# Altium project PID_preheaterV1.PrjPcb
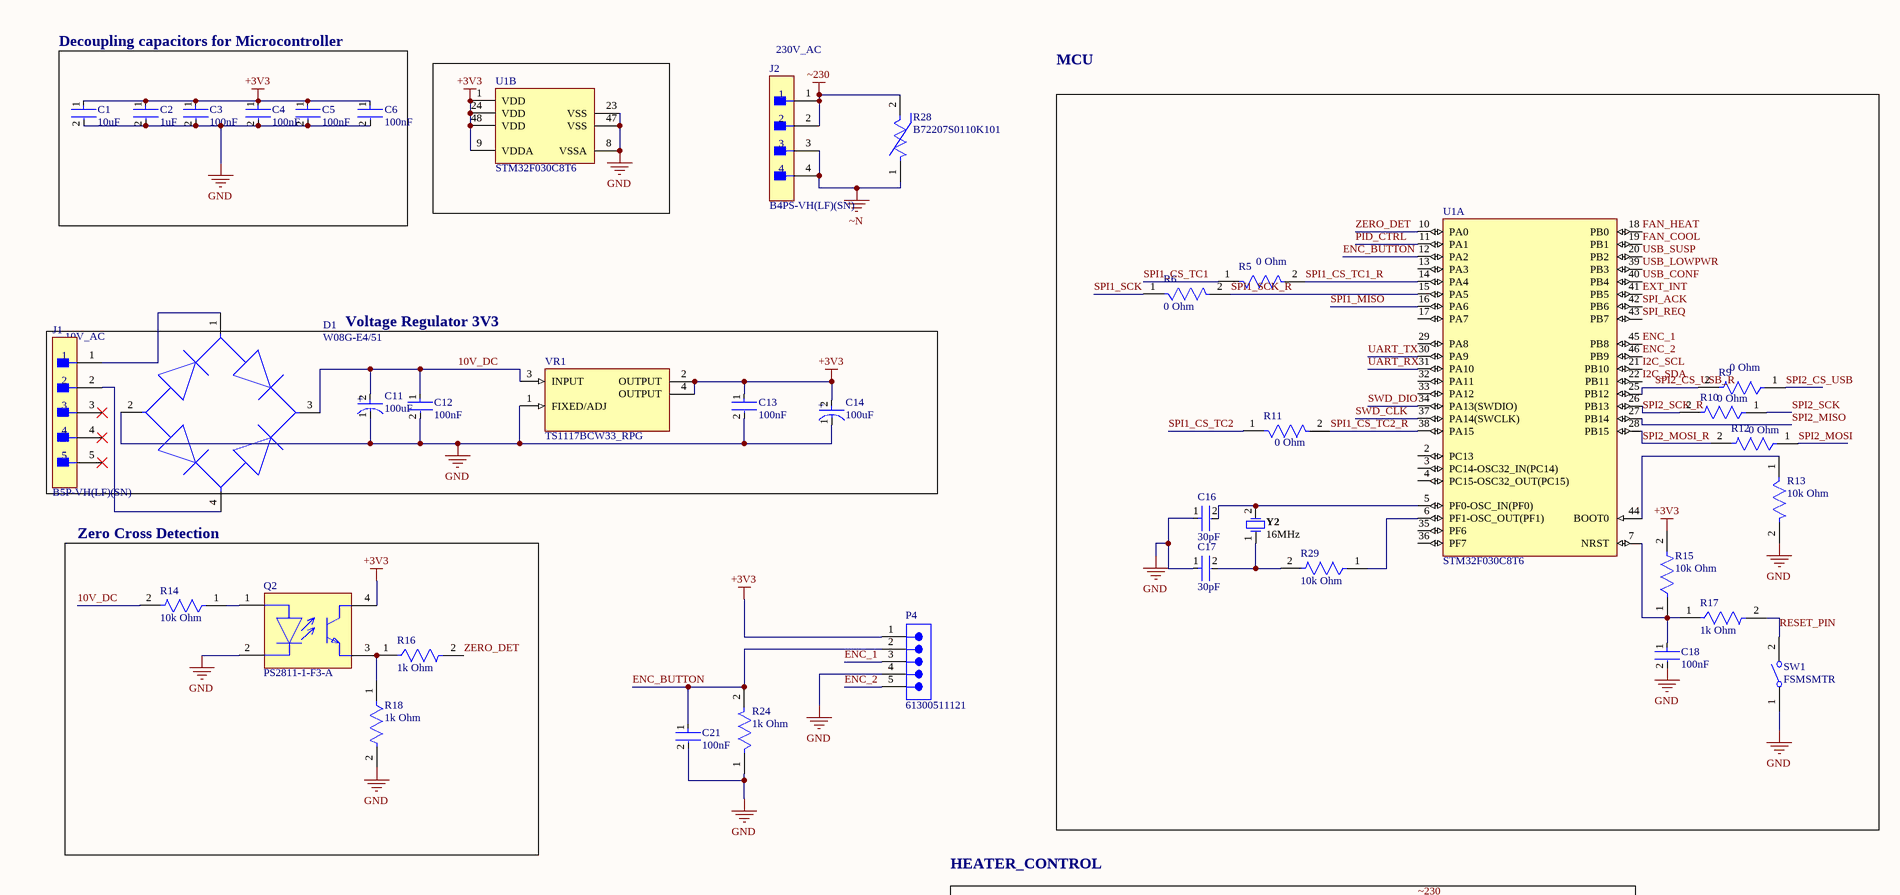
[diagram p0: SheetV1.SchDoc, top left]
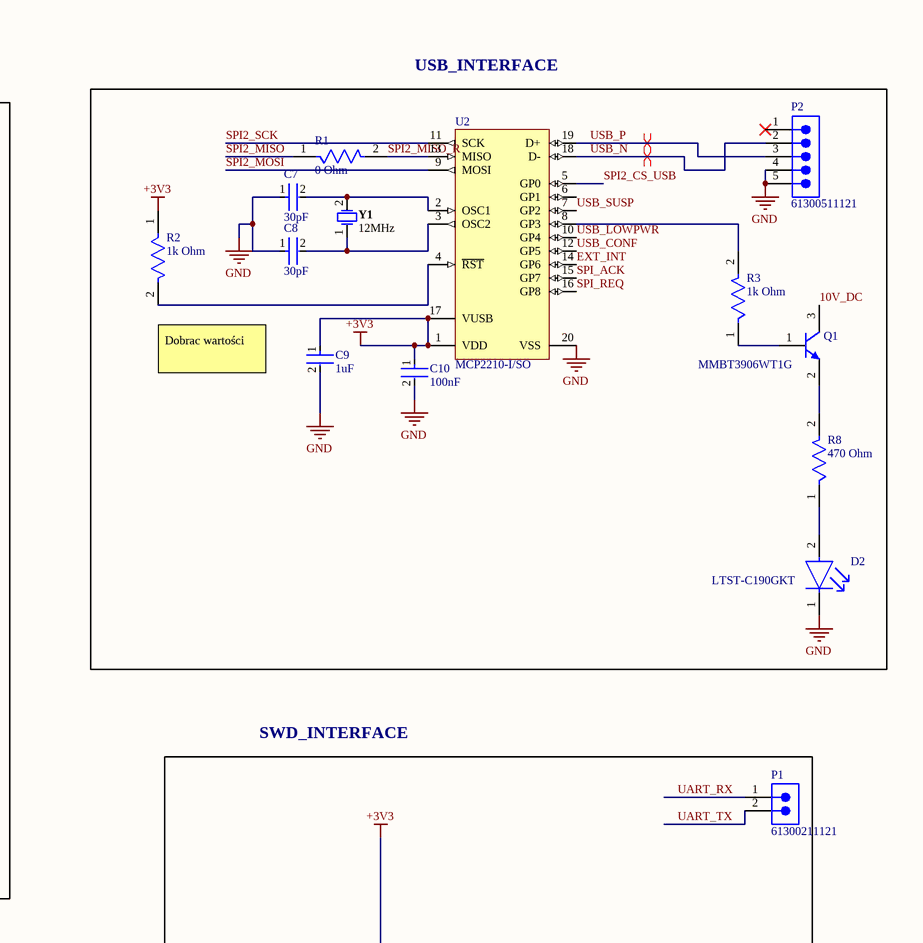
[diagram p1: SheetV1.SchDoc, top right]
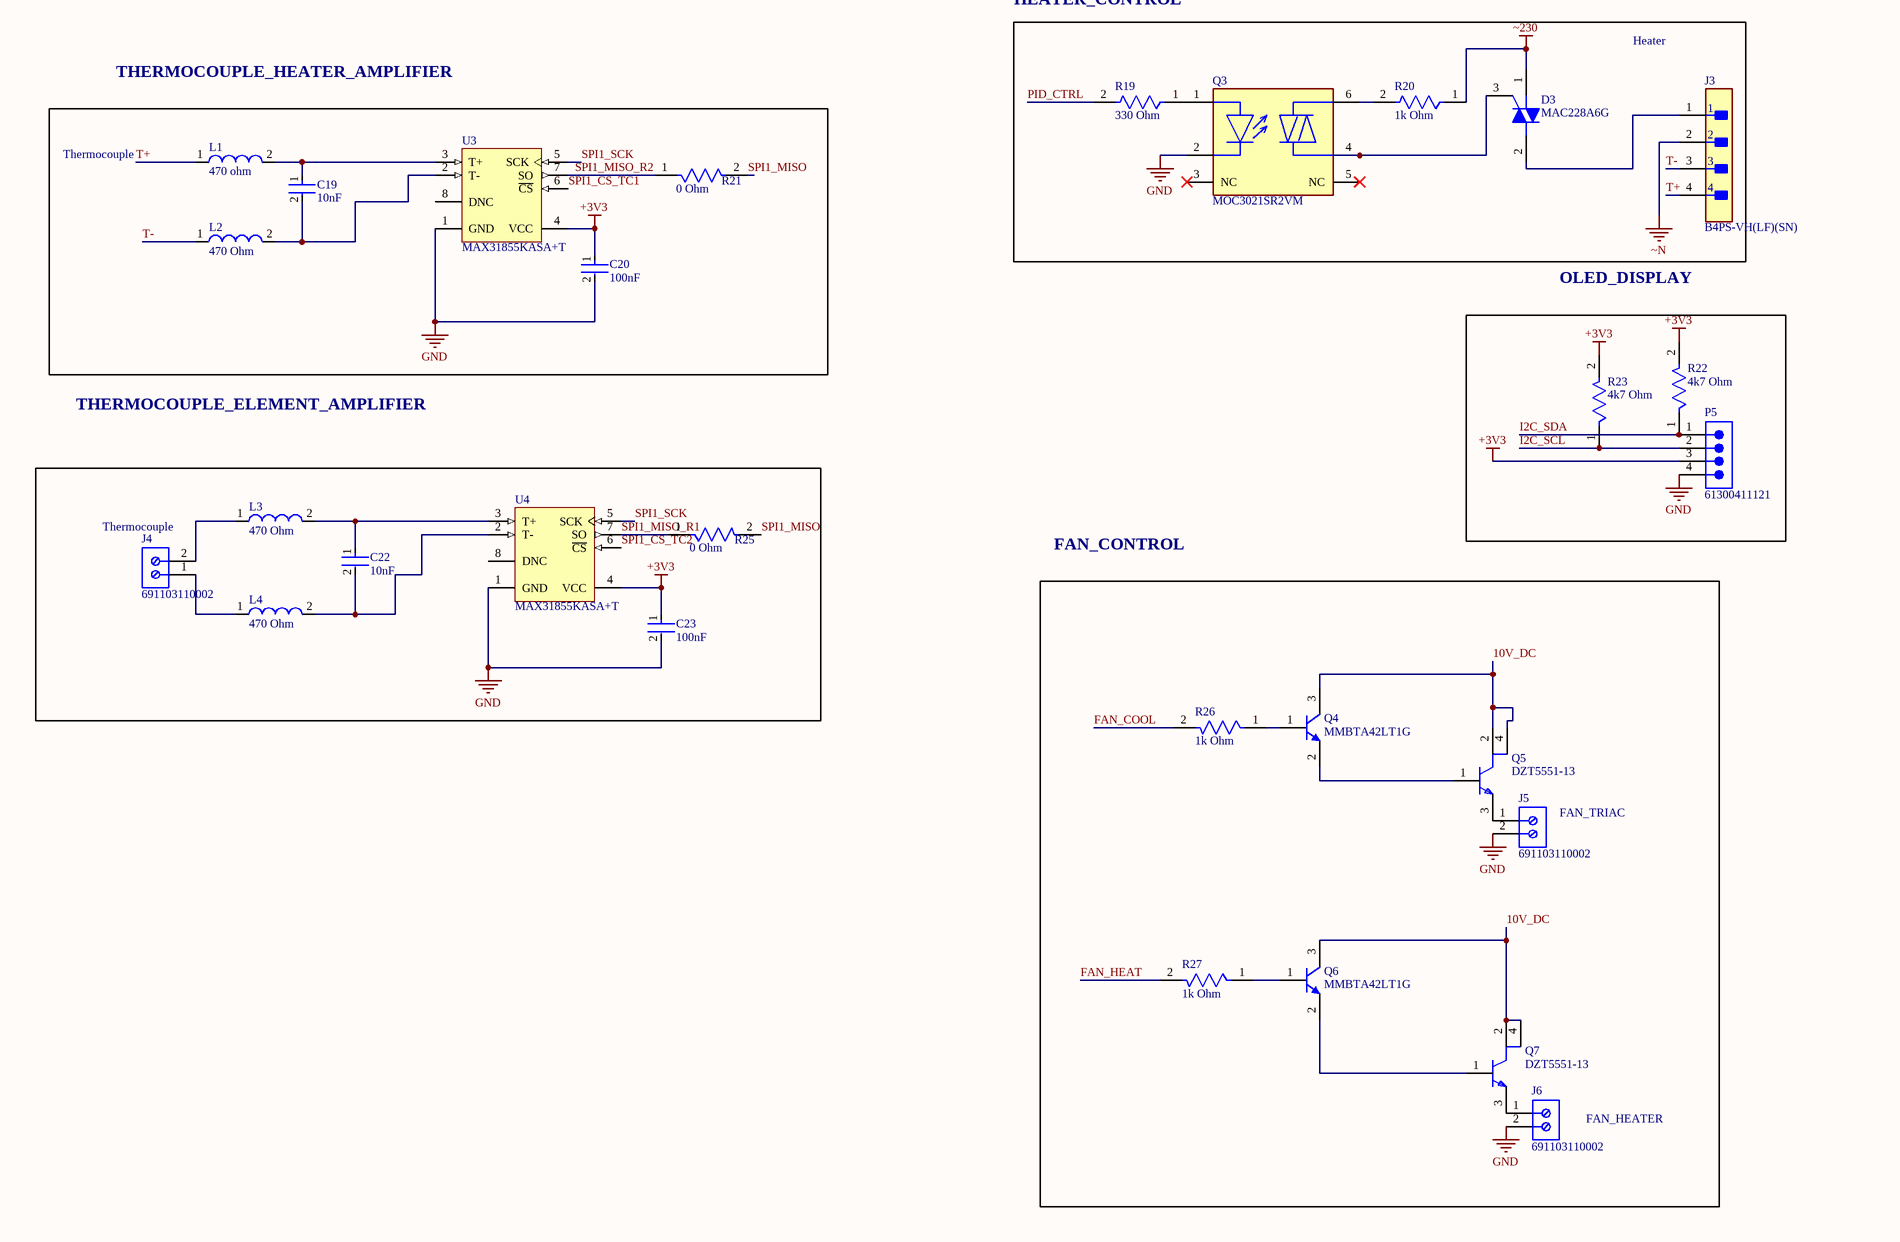
[diagram p2: SheetV1.SchDoc, bottom left]
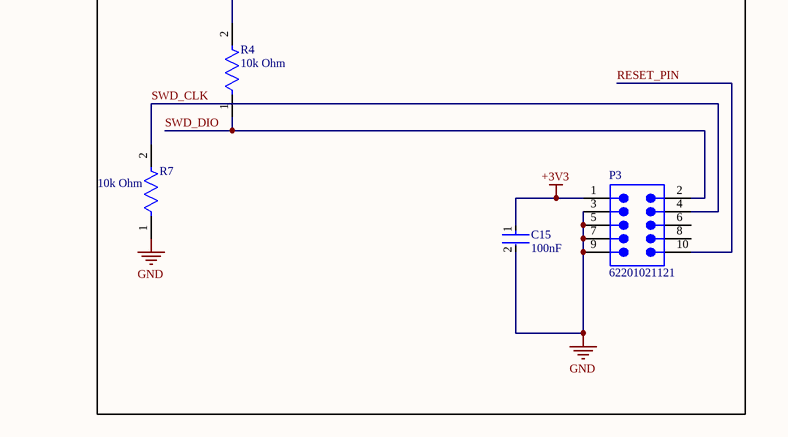
[diagram p3: SheetV1.SchDoc, bottom right]
1 sheet, 85 parts. Net scope: global (net labels, ports and power ports of the same name join across sheets).
Board file: PCBV1.PcbDoc

## Sheet SheetV1.SchDoc: PID Heater upgrade
size A1; Author: Grzegorz Jabłoński; DrawnBy: Grzegorz Jabłoński; DocumentNumber: 1/1; Revision: V1.0; SheetNumber: 1; SheetTotal: 1

### Parts
C1  10uF  [FP-CC0805-0_85-MFG]
C2  1uF  [FP-CC0805-0_85-MFG]
C3  100nF  [FP-CC0805-0_85-MFG]
C4  100nF  [FP-CC0805-0_85-MFG]
C5  100nF  [FP-CC0805-0_85-MFG]
C6  100nF  [FP-CC0805-0_85-MFG]
C7  30pF  [FP-CC0805-0_85-MFG]
C8  30pF  [FP-CC0805-0_85-MFG]
C9  1uF  [FP-CC0805-0_85-MFG]
C10  100nF  [FP-CC0805-0_85-MFG]
C11  100uF  [FP-RAD-TH-D_10_0_5-L_12_5-MFG]
C12  100nF  [FP-CC0805-0_85-MFG]
C13  100nF  [FP-CC0805-0_85-MFG]
C14  100uF  [FP-RAD-TH-D_10_0_5-L_12_5-MFG]
C15  100nF  [FP-CC0805-0_85-MFG]
C16  30pF  [FP-CC0805-0_85-MFG]
C17  30pF  [FP-CC0805-0_85-MFG]
C18  100nF  [FP-CC0805-0_85-MFG]
C19  10nF  [FP-CC0805-0_85-MFG]
C20  100nF  [FP-CC0805-0_85-MFG]
C21  100nF  [FP-CC0805-0_85-MFG]
C22  10nF  [FP-CC0805-0_85-MFG]
C23  100nF  [FP-CC0805-0_85-MFG]
D1  W08G-E4/51  [FP-WOG-MFG]
D2  LTST-C190GKT  [FP-LTST-C190GKT-MFG]
D3  MAC228A6G  [ONSC-TO-220-3-221A-09]
J1  B5P-VH(LF)(SN)  [FP-B5P-VH_LF_SN-MFG]
J2  B4PS-VH(LF)(SN)  [FP-B4PS-VH_LF_SN-MFG]
J3  B4PS-VH(LF)(SN)  [FP-B4PS-VH_LF_SN-MFG]
J4  691103110002  [691103110002]
J5  691103110002  [691103110002]
J6  691103110002  [691103110002]
L1  470 ohm  [SMD-0805]
L2  470 Ohm  [SMD-0805]
L3  470 Ohm  [SMD-0805]
L4  470 Ohm  [SMD-0805]
P1  61300211121  [61300211121]
P2  61300511121  [61300511121]
P3  62201021121  [62201021121]
P4  61300511121  [61300511121]
P5  61300411121  [61300411121]
Q1  MMBT3906WT1G  [ONSC-SC-70-3-419-04_V]
Q2  PS2811-1-F3-A  [SOP127P700X210_HS-5_SO4-Opto2_N]
Q3  MOC3021SR2VM  [FP-646BY-MFG]
Q4  MMBTA42LT1G  [ONSC-SOT-23-3-318-08_V]
Q5  DZT5551-13  [FP-SOT223-MFG]
Q6  MMBTA42LT1G  [ONSC-SOT-23-3-318-08_V]
Q7  DZT5551-13  [FP-SOT223-MFG]
R1  0 Ohm  [FP-RMCF0805-MFG]
R2  1k Ohm  [FP-RMCF0805-MFG]
R3  1k Ohm  [FP-RMCF0805-MFG]
R4  10k Ohm  [FP-RMCF0805-MFG]
R5  0 Ohm  [FP-RMCF0805-MFG]
R6  0 Ohm  [FP-RMCF0805-MFG]
R7  10k Ohm  [FP-RMCF0805-MFG]
R8  470 Ohm  [FP-RMCF0805-MFG]
R9  0 Ohm  [FP-RMCF0805-MFG]
R10  0 Ohm  [FP-RMCF0805-MFG]
R11  0 Ohm  [FP-RMCF0805-MFG]
R12  0 Ohm  [FP-RMCF0805-MFG]
R13  10k Ohm  [FP-RMCF0805-MFG]
R14  10k Ohm  [FP-RMCF0805-MFG]
R15  10k Ohm  [FP-RMCF0805-MFG]
R16  1k Ohm  [FP-RMCF0805-MFG]
R17  1k Ohm  [FP-RMCF0805-MFG]
R18  1k Ohm  [FP-RMCF0805-MFG]
R19  330 Ohm  [FP-RMCF0805-MFG]
R20  1k Ohm  [FP-RMCF0805-MFG]
R21  0 Ohm  [FP-RMCF0805-MFG]
R22  4k7 Ohm  [FP-RMCF0805-MFG]
R23  4k7 Ohm  [FP-RMCF0805-MFG]
R24  1k Ohm  [FP-RMCF0805-MFG]
R25  0 Ohm  [FP-RMCF0805-MFG]
R26  1k Ohm  [FP-RMCF0805-MFG]
R27  1k Ohm  [FP-RMCF0805-MFG]
R28  B72207S0110K101  [FP-B72207S0110K101-MFG]
R29  10k Ohm  [FP-RMCF0805-MFG]
SW1  FSMSMTR  [TECO-FSMSMTR_V]
U1  STM32F030C8T6  [STM-LQFP48_M]  (parts A,B of 2)
U2  MCP2210-I/SO  [SOIC-SO20_N]
U3  MAX31855KASA+T  [MAXM-S8+4_N]
U4  MAX31855KASA+T  [MAXM-S8+4_N]
VR1  TS1117BCW33_RPG  [VREG_TS1117BCW50_RPG]
Y1  12MHz  [FOX-FOXSLF160-20]
Y2  16MHz  [FOX-FOXSLF160-20]

### Blocks framed on the sheet
Decoupling capacitors for Microcontroller: C1-C6
USB_INTERFACE: C7-C10 D2 P2 Q1 R1-R3 R8 U2 Y1
Voltage Regulator 3V3: C11-C14 D1 J1 VR1
Zero Cross Detection: Q2 R14 R16 R18
SWD_INTERFACE: C15 P1 P3 R4 R7
HEATER_CONTROL: D3 J3 Q3 R19 R20
Thermocouple: C19 C20 L1 L2 R21 U3
Thermocouple: C22 C23 J4 L3 L4 R25 U4

### Nets
+3V3: C1.1 C2.1 C3.1 C4.1 C5.1 C6.1 C9.1 C10.1 C13.1 C14.2(A) C15.1 C20.1 C23.1 P3.1 P4.1 P5.3 Q2.4(C) R2.1 R4.2 R15.2 R22.2 R23.2 U1.1(VDD) U1.9(VDDA) U1.24(VDD) U1.48(VDD) U2.1(VDD) U2.17(VUSB) U3.4(VCC) U4.4(VCC) VR1.2(OUTPUT) VR1.4(OUTPUT)
GND: C1.2 C2.2 C3.2 C4.2 C5.2 C6.2 C7.1 C8.1 C9.2 C10.2 C11.1(C) C12.2 C13.2 C14.1(C) C15.2 C16.1 C17.1 C18.2 C20.2 C21.2 C23.2 D1.2(+) D2.1(C) J5.2 J6.2 P2.4 P2.5 P3.3 P3.5 P3.7 P3.9 P4.4 P5.4 Q2.2(C) Q3.2(C) R7.1 R13.2 R18.2 R24.1 SW1.1 U1.8(VSSA) U1.23(VSS) U1.47(VSS) U2.20(VSS) U3.1(GND) U4.1(GND) VR1.1(FIXED/ADJ)
~230: D3.1(MT1) J2.1 J2.2 R20.1 R28.2
~N: J2.3 J2.4 J3.2 R28.1
10V_DC: C11.2(A) C12.1 D1.3(-) Q1.3(C) Q4.3(C) Q5.2(C) Q5.4(C) Q6.3(C) Q7.2(C) Q7.4(C) R14.2 VR1.3(INPUT)
ENC_1: P4.3 U1.45(PB8)
ENC_2: P4.5 U1.46(PB9)
ENC_BUTTON: C21.1 P4.2 R24.2 U1.12(PA2)
EXT_INT: U1.41(PB5) U2.14(GP6)
FAN_COOL: R26.2 U1.19(PB1)
FAN_HEAT: R27.2 U1.18(PB0)
I2C_SCL: P5.2 R23.1 U1.21(PB10)
I2C_SDA: P5.1 R22.1 U1.22(PB11)
PID_CTRL: R19.2 U1.11(PA1)
RESET_PIN: P3.10 R17.2 SW1.2
SPI1_CS_TC1: R5.1 U3.6(~{CS})
SPI1_CS_TC1_R: R5.2 U1.14(PA4)
SPI1_CS_TC2: R11.1 U4.6(~{CS})
SPI1_CS_TC2_R: R11.2 U1.38(PA15)
SPI1_MISO: R21.2 R25.2 U1.16(PA6)
SPI1_MISO_R1: R25.1 U4.7(SO)
SPI1_MISO_R2: R21.1 U3.7(SO)
SPI1_SCK: R6.1 U3.5(SCK) U4.5(SCK)
SPI1_SCK_R: R6.2 U1.15(PA5)
SPI2_CS_USB: R9.1 U2.5(GP0)
SPI2_CS_USB_R: R9.2 U1.25(PB12)
SPI2_MISO: R1.1 U1.27(PB14)
SPI2_MISO_R: R1.2 U2.13(MISO)
SPI2_MOSI: R12.1 U2.9(MOSI)
SPI2_MOSI_R: R12.2 U1.28(PB15)
SPI2_SCK: R10.1 U2.11(SCK)
SPI2_SCK_R: R10.2 U1.26(PB13)
SPI_ACK: U1.42(PB6) U2.15(GP7)
SPI_REQ: U1.43(PB7) U2.16(GP8)
SWD_CLK: P3.4 R7.2 U1.37(PA14(SWCLK))
SWD_DIO: P3.2 R4.1 U1.34(PA13(SWDIO))
T+: J3.4 L1.1
T-: J3.3 L2.1
UART_RX: P1.1 U1.31(PA10)
UART_TX: P1.2 U1.30(PA9)
USB_CONF: U1.40(PB4) U2.12(GP5)
USB_LOWPWR: U1.39(PB3) U2.10(GP4)
USB_N: P2.2 U2.18(D-)
USB_P: P2.3 U2.19(D+)
USB_SUSP: U1.20(PB2) U2.7(GP2)
ZERO_DET: R16.2 U1.10(PA0)
NetC7_2: C7.2 U2.2(OSC1) Y1.2
NetC8_2: C8.2 U2.3(OSC2) Y1.1
NetC16_2: C16.2 U1.5(PF0-OSC_IN(PF0)) Y2.2
NetC17_2: C17.2 R29.2 Y2.1
NetC18_1: C18.1 R15.1 R17.1 U1.7(NRST)
NetC19_1: C19.1 L1.2 U3.3(T+)
NetC19_2: C19.2 L2.2 U3.2(T-)
NetC22_1: C22.1 L3.2 U4.3(T+)
NetC22_2: C22.2 L4.2 U4.2(T-)
NetD1_1: D1.1(1_~) J1.1
NetD1_4: D1.4(2_~) J1.2
NetD2_2: D2.2(A) R8.1
NetD3_2: D3.2(MT2) J3.1
NetD3_3: D3.3(G) Q3.4(1_MAIN_TERM)
NetJ4_1: J4.1 L4.1
NetJ4_2: J4.2 L3.1
NetJ5_1: J5.1 Q5.3(E)
NetJ6_1: J6.1 Q7.3(E)
NetQ1_1: Q1.1(B) R3.1
NetQ1_2: Q1.2(E) R8.2
NetQ2_1: Q2.1(A) R14.1
NetQ2_3: Q2.3(E) R16.1 R18.1
NetQ3_1: Q3.1(A) R19.1
NetQ3_6: Q3.6(2_MAIN_TERM) R20.2
NetQ4_1: Q4.1(B) R26.1
NetQ4_2: Q4.2(E) Q5.1(B)
NetQ6_1: Q6.1(B) R27.1
NetQ6_2: Q6.2(E) Q7.1(B)
NetR2_2: R2.2 U2.4(~{RST})
NetR3_2: R3.2 U2.8(GP3)
NetR13_1: R13.1 U1.44(BOOT0)
NetR29_1: R29.1 U1.6(PF1-OSC_OUT(PF1))

Not connected (* = marked no-connect by the designer): J1 3* 4* 5*; P2 1*; P3 6 8; Q3 3(NC)* 5(NC)*; U1 2(PC13) 3(PC14-OSC32_IN(PC14)) 4(PC15-OSC32_OUT(PC15)) 13(PA3) 17(PA7) 29(PA8) 32(PA11) 33(PA12) 35(PF6) 36(PF7); U2 6(GP1); U3 8(DNC); U4 8(DNC)

### Layout directives
differential pair: USB_N, USB_P

### Notes on the sheet
- (near J2) 230V_AC
- MCU
- (near J1) 10V_AC
- Dobrac wartości
- THERMOCOUPLE_HEATER_AMPLIFIER
- Heater
- OLED_DISPLAY
- THERMOCOUPLE_ELEMENT_AMPLIFIER
- FAN_CONTROL
- FAN_TRIAC
- FAN_HEATER
- (in symbol CMP-05427-001012-1) +

### Library data of the parts
C1 C2 C7-C9 C16 C17 C19 C22 = CMP-2100-03606-3: CAP CER 0.1UF 50V X7R 0805; Manufacturer Part Number: CC0805KRX7R9BB104; Manufacturer: Yageo; Tolerance: 0.1; Capacitance: 100 nF; Value: 100 nF; Material: Ceramic; Device Class L1: Passive Components; ComponentLink2Description: Datasheet; Package: CC0805-0.85; Digikey Description: CAP CER 0.1UF 50V X7R 0805; Device Class L3: Ceramic Capacitors; Temperature: -30°C to +85°C; Temperature Characteristic: X7R; Voltage Rating: 50 V; Height: 0.95mm; RoHS: TRUE; Ipc Land Pattern Name: CAPC200125X85; Device Class L2: Capacitors; Category: Cap; Temperature Range Low: -30°C; Temperature Range High: +85°C; Mouser Description: Multilayer Ceramic Capacitors MLCC - SMD/SMT 100nF 50V X7R 10%; Footprint Url: http://www.yageo.com/exep/pages/download/literatures/UPY-C_GEN_24.pdf; Automotive: No; Octopart: https://octopart.com/cc0805krx7r9bb104-yageo-192993; Lead Free: Yes; ComponentLink2URL: http://www.yageo.com/documents/recent/UPY-GPHC_Y5V_6.3V-to-50V_8.pdf
C3-C6 C10 C12 C13 C15 C18 C20 C21 C23 = CMP-2100-03606-3: CAP CER 0.1UF 50V X7R 0805; Manufacturer Part Number: CC0805KRX7R9BB104; Manufacturer: Yageo; Tolerance: 0.1; Material: Ceramic; Device Class L1: Passive Components; ComponentLink2Description: Datasheet; Package: CC0805-0.85; Digikey Description: CAP CER 0.1UF 50V X7R 0805; Capacitance: 100 nF; Device Class L3: Ceramic Capacitors; Value: 100 nF; Temperature: -30°C to +85°C; Temperature Characteristic: X7R; Voltage Rating: 50 V; Height: 0.95mm; RoHS: TRUE; Ipc Land Pattern Name: CAPC200125X85; Device Class L2: Capacitors; Category: Cap; Temperature Range Low: -30°C; Temperature Range High: +85°C; Mouser Description: Multilayer Ceramic Capacitors MLCC - SMD/SMT 100nF 50V X7R 10%; Footprint Url: http://www.yageo.com/exep/pages/download/literatures/UPY-C_GEN_24.pdf; Automotive: No; Octopart: https://octopart.com/cc0805krx7r9bb104-yageo-192993; Lead Free: Yes; ComponentLink2URL: http://www.yageo.com/documents/recent/UPY-GPHC_Y5V_6.3V-to-50V_8.pdf
C11 C14 = CMP-05427-001012-1: Aluminum Electrolytic Capacitors (Radial Lead Type) 3.3uF ±20% 400V; Dielectric Material: Aluminium; Ripple Current (AC): 40mA; Lead/Base Style: Straight; Life (Hours): 2000Hour; Lead Diameter: 0.6mm; Polarity: Polar; Voltage Rating (DC): 400V; Max Operating Temperature: 105°C; Lead Pitch: 5mm; Termination: Radial; Lead Free: Lead Free; Radiation Hardening: No; Voltage Rating: 400V; Tolerance: 20%; Construction: RADIAL; Ripple Current: 40mA; Min Operating Temperature: -25°C; Diameter: 10mm; Contact Plating: Tin; Package Quantity: 200; Mount: Through Hole; REACH SVHC: No SVHC; Height: 12.5mm; Case/Package: Radial; Height - Seated (Max): 0.531inch; RoHS Compliant: Yes; Series: NHG; Capacitance: 3.3uF; Packaging: Bulk; Number of Pins: 2; Voltage: 400V; Length: 12.5mm
D1 = CMP-00030-42174390-1: W08G-E4/51 Diode Rectifier Bridge Single 800V 1.5A 4-Pin Case WOG Bulk; Peak Reverse Current: 5µA; Number of Elements: 1; Forward Voltage: 1V; Max Surge Current: 50A; Capacitance: 14pF; Lead Free: Lead Free; Element Configuration: Single; Number of Pins: 4; Breakdown Voltage: 800V; Average Rectified Current: 1.5A; Width: 8.84mm; Max Repetitive Reverse Voltage (Vrrm): 800V; RoHS: Compliant; Length: 9.86mm; REACH SVHC: Unknown; NexarPartId: 42174390; Forward Current: 1.5A; Radiation Hardening: No; Height: 5.6mm; Diameter: 9mm; Min Operating Temperature: -55°C; Peak Non-Repetitive Surge Current: 50A; Schedule B: 8541100080, 8541100080; Max Reverse Leakage Current: 5µA; Max Operating Temperature: 150°C; Mount: Through Hole; Output Current: 1.5A
D2 = CMP-22017-000005-2: LED GREEN CLEAR CHIP SMD; Dominant Wavelength: 569nm; Reverse Voltage: 5V; Lens Color: Colorless; Viewing Angle: 130°; Voltage: 2V; Forward Current: 30mA; Power Dissipation: 100mW; Luminous Intensity: 6mcd; Number of LEDs: 1; Forward Voltage: 2.1V; Wavelength: 565nm; Test Current: 10mA; Min Operating Temperature: -55°C; Lens Style: Clear; Mount: Surface Mount; Width: 0.8mm; Packaging: Tape and Reel; Lens Transparency: Clear; Case Code (Metric): 1608; Depth: 0.8mm; Case Code (Imperial): 0603; Case/Package: 0603; Number of Pins: 2; Max Operating Temperature: 85°C; Lead Free: Lead Free; Number of Elements: 1; Length: 1.6mm; Height: 0.8mm; Package Quantity: 1; Power Rating: 100mW; Radiation Hardening: No; Illumination Color: Green; Color: Green
D3 = CMP-1070-00099-1: Sensitive Gate Triacs, Silicon Bidirectional Thyristor, 3-Pin TO-220, Pb-Free, Bulk Box; Manufacturer: On Semiconductor; ITSM Max (A): 80; IT(RMS) Max (A): 8; DatasheetVersion: Rev. 7; ComponentLink2Description: Datasheet; PackageDescription: 3-Pin Flange Mount, Vertical Straight Lead, Body 9.97 x 4.445 mm, Pitch 2.54 mm; Packing: Bulk Box; ComponentLink3Description: Package Specification; RoHS: Pb-Free; ComponentLink2URL: http://www.onsemi.com/pub_link/Collateral/MAC228A-D.PDF; PartNumber: MAC228A6G; ComponentLink3URL: http://www.onsemi.com/pub_link/Collateral/221A-09.PDF; ComponentLink1URL: http://www.onsemi.com/; PackageVersion: Rev. AG, 09/2011; PackageReference: TO-220-3-221A-09; ComponentLink1Description: Manufacturer URL; Mounting Technology: Through Hole
J1 = CMP-17439-000253-1: CONN HEADER VERT 5POS 3.96MM; Voltage Rating: 250V; Current Rating: 10A; Gender: Male; Contact Resistance: 20mR; Number of Positions: 5; Mated Stacking Heights: 16.5mm; Mount: Through Hole; Housing Color: White; REACH SVHC: No SVHC; Contact Mating Length: 0.303inch; Insulation Material: Nylon; Contact Type: Male Pin; Min Operating Temperature: -25°C; Lead Free: Lead Free; Contact Shape: Square; Color: Natural; Packaging: Bulk; Flammability Rating: UL94 V-0; Number of Rows: 1; Max Operating Temperature: 85°C; Pitch: 3.96mm; Fastening Type: Ramp; Number of Pins: 5; Termination: Solder; Width: 14.6mm; Orientation: Straight; Max Current Rating: 10A; Housing Material: Polyamide; Height: 8.5mm; Length: 19.74mm; Contact Plating: Copper; Contact Finish - Mating: TIN; Depth: 8.5mm; Connector Type: Header; Max Voltage Rating (AC): 250V; Contact Material: Brass; Insulation Color: Natural; Number of Contacts: 5; Series: VH
J2 J3 = CMP-17439-000047-1: CONN HEADER R/A 4POS 3.96MM; Max Current Rating: 10A; Contact Resistance: 20mR; Number of Positions: 4; Max Voltage Rating (AC): 250V; Gender: Male; Insulation Resistance: 1GR; Contact Material: Brass; Insulation Material: Nylon; Housing Material: Polyamide; Termination: Solder; Depth: 14.9mm; Contact Type: Male Pin; Working Voltage: 250V; Voltage Rating (AC): 250V; Voltage Rating (DC): 250V; Contact Finish - Mating: TIN; Packaging: Bulk; Series: VH; Connector Type: Header; Current Rating: 10A; Contact Mating Length: 0.303inch; Flammability Rating: UL94 V-0; Pitch: 3.96mm; Min Operating Temperature: -25°C; Insulation Color: Natural; Mount: Through Hole; Max Operating Temperature: 85°C; Housing Color: White; REACH SVHC: No SVHC; Contact Shape: Square; Fastening Type: Ramp; Color: Natural; Contact Plating: Copper; Lead Free: Lead Free; Number of Rows: 1; Lead Pitch: 3.96mm; Length: 15.78mm; Number of Contacts: 4; Orientation: Right Angle; Voltage Rating: 250V
J4-J6 = CMP-1502-03254-2: NexarPartId: 18818286; Pitch: 3.5052mm; Current Rating: 10A; Number of Positions Per Level: 2; Plating: Steel; Number of Levels: 1; Voltage: 125V; Wire/Cable Gauge: 26AWG; Stripping Length: -6mm; Wire Gauge (Min): 16AWG; Packaging: Box; Number of Rows: 1; Color: Blue; Height: 8.5mm; Current: 10A; Lead Pitch: 3.5mm; RoHS: Compliant; Housing Material: Nylon; Width: 8mm; Length: 7mm; Contact Plating: Tin; Number of Pins: 2; Mount: Through Hole; Min Operating Temperature: -40°C; Number of Contacts: 2; REACH SVHC: Unknown; Termination: Screw; Wire Gauge (Max): 26AWG; Max Operating Temperature: 105°C; Voltage Rating: 125V; Contact Material: Brass, Copper, Nickel, Tin, Zinc
L1-L4 = CMP-0220-00035-1: SMD EMI Suppression Ferrite Bead WE-CBF, Z = 470 Ohm; PackageReference: SMD-0805; PackageVersion: 2005; ComponentLink2URL: http://www.we-online.de/katalog/media/pdf/742792036.pdf; ComponentLink1Description: Manufacturer Link; ComponentLink2Description: Datasheet; Impedance: 470 Ohm; DatasheetVersion: Dec-2005; ComponentLink1URL: http://www.we-online.com; PackageDescription: Chip Inductor, 2-Leads, Body 2.0 x 1.2 mm
P1 = CMP-1712-00002-6: NexarPartId: 20081794; Number of Contacts: 2; Pitch: 2.54mm; Connector Type: Male Pin; Voltage Rating: 250V; Current Rating: 3A; Gender: Male; Contact Resistance: 20mΩ; Height: 8.94mm; Lead Free: Lead Free; Number of Pins: 2; Termination: Through Hole; RoHS: Compliant; Lead Pitch: 2.54mm; REACH SVHC: No SVHC; Housing Material: PBT; Contact Mating Length: 5.9944mm; Min Operating Temperature: -40°C; Orientation: Vertical; Contact Material: Copper; Contact Gender: Male; Max Operating Temperature: 125°C; Number of Rows: 1; Number of Positions: 2; Packaging: Bulk; Contact Plating: Gold; Mount: Through Hole; Color: Black; Operating Supply Voltage: 250V
P2 P4 = CMP-1502-01068-3: NexarPartId: 32855526; Connector Type: Male Pin; Gender: Male; Contact Resistance: 20mΩ; Pitch: 2.54mm; Operating Supply Voltage: 250V; Current Rating: 3A; Number of Contacts: 5; Lead Free: Lead Free; Color: Black; Packaging: Bulk; Lead Pitch: 2.54mm; Contact Material: Copper; Min Operating Temperature: -40°C; Contact Mating Length: 5.9944mm; Voltage Rating: 250V; Number of Pins: 5; Number of Positions: 5; Height: 8.89mm; Orientation: Vertical; REACH SVHC: Unknown; RoHS: Compliant; Contact Plating: Gold; Max Operating Temperature: 105°C; Mount: Through Hole; Number of Rows: 1; Termination: Solder
P3 = CMP-1502-00948-3: NexarPartId: 32855586; Pitch: 1.27mm; Operating Supply Voltage: 100V; Connector Type: Male Pin; Contact Resistance: 20mΩ; Current Rating: 1A; Number of Contacts: 10; Gender: Male; Contact Mating Length: 3.81mm; Max Operating Temperature: 105°C; Mount: Through Hole; Number of Pins: 10; Row Spacing: 1.27mm; Lead Pitch: 1.27mm; REACH SVHC: Unknown; Min Operating Temperature: -40°C; Contact Material: Copper; Orientation: Vertical; Contact Plating: Gold; Number of Rows: 2; RoHS: Compliant; Packaging: Box; Voltage Rating: 100V; Color: Black; Height: 5.65mm; Termination: Solder; Number of Positions: 10
P5 = CMP-1502-01064-3: NexarPartId: 32855522; Operating Supply Voltage: 250V; Pitch: 2.54mm; Contact Resistance: 20mΩ; Number of Positions: 4; Current Rating: 3A; Connector Type: Male Pin; Gender: Male; Contact Plating: Gold; Height: 8.89mm; Lead Pitch: 2.54mm; Lead Free: Lead Free; Contact Mating Length: 5.9944mm; Number of Rows: 1; Termination: Solder; Packaging: Bulk; REACH SVHC: Unknown; Min Operating Temperature: -40°C; RoHS: Compliant; Number of Contacts: 4; Voltage Rating: 250V; Color: Black; Max Operating Temperature: 105°C; Contact Material: Copper; Mount: Through Hole; Orientation: Vertical; Number of Pins: 4
Q1 = CMP-1048-00381-1: General Purpose Transistor, PNP Silicon, 3-Pin SC70, Pb-Free, Tape and Reel; Manufacturer: On Semiconductor; IC Continuous (A): -0.2; fT Min (MHz): 250; PackageDescription: 3-Pin Small Outline Transistor, Body 2 x 1.25 mm, Pitch 0.65 mm; PartNumber: MMBT3906WT1G; ComponentLink2Description: Datasheet; Packing: Tape and Reel; Mounting Technology: Surface Mount; ComponentLink3Description: Package Specification; DatasheetVersion: Rev. 8; ComponentLink2URL: http://www.onsemi.cn/pub_link/Collateral/MMBT3904WT1-D.PDF; Polarity: PNP; ComponentLink3URL: http://www.onsemi.cn/pub_link/Collateral/419-04.PDF; ComponentLink1Description: Manufacturer URL; PackageReference: SC-70-3-419-04; ComponentLink1URL: http://www.onsemi.com/; RoHS: TRUE; PackageVersion: Rev. N, 11/2008
Q2 = CMP-00572-23028373-2: Optocoupler DC-IN 1-CH Transistor DC-OUT 4-Pin SSOP Embossed T/R; Manufacturer Lifecycle Status: ACTIVE; Max Input Current: 1A; Collector Emitter Saturation Voltage: 300mV; Current Transfer Ratio: 400%; Number of Circuits: 1; Forward Voltage: 1.4V; Max Power Dissipation: 120mW; Rise Time: 4µs; Max Collector Current: 40mA; Output Voltage: 40V; Forward Current: 50mA; Input Current: 5mA; Isolation Voltage: 2.5kV; Reverse Breakdown Voltage: 6V; ComponentLink1Description: Manufacturer's Website; Packaging: Cut Tape; RoHS: Compliant; Case/Package: SSOP; HelpURL: https://octopart.com/cad-content/api/get-model-datasheet/15189/23028373; Lead Free: Lead Free; Min Operating Temperature: -55°C; Height: 2.1mm; Number of Elements: 1; China RoHS: Compliant; Mount: Surface Mount; Number of Channels: 1; Lifecycle Status: Production; ComponentLink2URL: https://octopart.com/cad-content/api/get-model-datasheet/15189/23028373; Number of Pins: 4; Radiation Hardening: No; Collector Emitter Voltage (VCEO): 40V; ComponentLink2Description: Datasheet URL; ComponentLink1URL: http://www.renesas.com; REACH SVHC: No SVHC; Max Operating Temperature: 100°C
Q3 = CMP-00278-84330366-1: MOC3021SR2VM Triac Driver Output Optocoupler, 6-Pin DIP 400V Random Phase; Manufacturer Lifecycle Status: ACTIVE; Isolation Voltage: 7.5kV; Power Dissipation: 330mW; Hold Current: 100µA; Number of Circuits: 1; Approvals: EN, IEC, UL; Input Current: 60mA; Nominal Input Voltage: 1.15V; Reverse Breakdown Voltage: 3V; Max Input Voltage: 1.5V; Max Operating Temperature: 85°C; Weight: 810mg; Mount: Surface Mount; REACH SVHC: No SVHC; Case/Package: SMD/SMT; NexarPartId: 84330366; RoHS: Compliant; Lead Free: Lead Free; Schedule B: 8541408000, 8541408000; Number of Elements: 1; Number of Channels: 1; Packaging: Digi-Reel®; Forward Voltage: 1.15V; Forward Current: 60mA; Number of Pins: 6; Radiation Hardening: No; Output Voltage: 400V; Max Power Dissipation: 330mW; Lifecycle Status: Production; Min Operating Temperature: -40°C
Q4 Q6 = CMP-1048-00662-1: High Voltage Transistor, NPN Silicon, 3-Pin SOT-23, Pb-Free, Tape and Reel; Manufacturer: On Semiconductor; fT Min (MHz): 50; IC Continuous (A): 0.5; ComponentLink1URL: http://www.onsemi.com/; ComponentLink3URL: http://www.onsemi.cn/pub_link/Collateral/318-08.PDF; RoHS: TRUE; ComponentLink2Description: Datasheet; PartNumber: MMBTA42LT1G; Polarity: NPN; DatasheetVersion: Rev. 12; PackageReference: SOT-23-3-318-08; PackageDescription: 3-Pin Small Outline Transistor, Body 2.92 x 1.3 mm, Pitch 0.95 mm; ComponentLink3Description: Package Specification; ComponentLink1Description: Manufacturer URL; Packing: Tape and Reel; PackageVersion: Rev. AP, 11/2009; Mounting Technology: Surface Mount; ComponentLink2URL: http://www.onsemi.cn/pub_link/Collateral/MMBTA42LT1-D.PDF
Q5 Q7 = CMP-12798-000002-1: TRANS NPN 160V 0.6A SOT-223; Manufacturer: Diodes; Hfe Ss Min: 50; Rthja Max: 62.5°C/W; Emitter Base Voltage: 6V; Automotive Grade: Grade 0; Hfe Testic: 10mA; Hfe Ss Testic: 10A; Max Junction Temp: +150°C; Hfe Max: 250; Fall Time Tf: 140ns; Collector Base Voltage: 180V; Unity Gain Freq: 130MHz; Number Of Npn: 1; Standoff Height: 0.01mm; Delay Time Td: 95ns; Collector Emitter Breakdown Voltage: 200V; Hfe Ss Max: 260; Max Collector Current: 600mA; Hfe Testvce: 5V; Hfe Ss Testvce: 10V; Collector Emitter Saturation Voltage: 115mV; Hfe Min: 80; Rise Time Tr: 64ns; Power Dissipation: 2W; Footprint Url: https://www.diodes.com/assets/Package-Files/SOT223.pdf; ComponentLink2URL: https://www.diodes.com/assets/Datasheets/ds31219.pdf; Device Class L2: Transistors; Lead Free: Yes; Storage Time Ts: 1256ns; Temperature Range Low: -55°C; Mouser Description: Bipolar Transistors - BJT 1000mW 160Vceo; RoHS: TRUE; Collector Emitter Voltage: 160V; ComponentLink2Description: Datasheet; Device Class L3: BJTs; Automotive: Yes; Temperature: -55°C to +150°C; Package: SOT223; Device Class L1: Discrete Semiconductors; Temperature Range High: +150°C; Category: Trans; Digikey Description: TRANS NPN 160V 0.6A SOT-223; Height: 1.8mm; Octopart: https://octopart.com/dzt5551-13-diodes+inc.-12426785; Number Of Elements: 1; Manufacturer Part Number: DZT5551-13
R1-R27 R29 = CMP-26527-000017-1: RES 0 OHM JUMPER 1/8W 0805; Power Rating: 125mW; Resistance: 0mR; Depth: 1.25mm; Length: 2mm; Military Standard: Not; Width: 0.049inch; Case Code (Imperial): 0805; Number of Terminations: 2; Mount: Surface Mount; Contact Plating: Tin; Height: 0.026inch; Case/Package: 0805; Min Operating Temperature: -55°C; Composition: Thick Film; Max Operating Temperature: 155°C; Packaging: Tape and Reel; Features: Automotive AEC-Q200; Max Power Dissipation: 125mW; Radiation Hardening: No; Lead Free: Lead Free; Case Code (Metric): 2012
R28 = CMP-10618-000012-1: VARISTOR 18V 250A DISC 7MM; Manufacturer: EPCOS; Voltage Rating Ac: 11V; Voltage Rating Dc: 14V; Clamping Voltage: 36V; Capacitance: 2750pF; Clamping Current: 2.5A; Value: 2750pF; Voltage Tolerance: 10%; ComponentLink2URL: https://product.tdk.com/info/en/documents/data_sheet/70/db/var/SIOV_Leaded_StandarD.pdf; Device Class L2: Varistors; Temperature: -40°C to +105°C; ComponentLink2Description: Datasheet; Device Class L3: unset; Lead Free: Yes; Package: B72207S0110K101; Automotive: No; Height: 11mm; Temperature Range Low: -40°C; RoHS: TRUE; Device Class L1: Circuit Protection; Varistor Voltage: 18V; Manufacturer Part Number: B72207S0110K101; Temperature Range High: +105°C; Octopart: https://octopart.com/b72207s0110k101-epcos-11931358; Category: Res; Mouser Description: Varistor: metal-oxide; THT; 11VAC; 14VDC; 18V; 250A; 800mJ; Digikey Description: VARISTOR 18V 250A DISC 7MM
SW1 = CMP-2000-07501-1: FSMSM Push Button Switch, 50 mA, -35 to 85 degC, 2-Pin SMD, RoHS, Tape and Reel; Manufacturer: TE Connectivity; Voltage Rating (DC): 24V; Electrical Life: 20000Cycles; Operating Force: 180gf; Switch Travel: 0.25mm; Contact Current Rating: 50mA; Case\/Package: SMD/SMT; Actuator Length: 1.07mm; Throw Configuration: SPST; Actuator Material: Polyamide; Contact Resistance: 100mOhm; Illumination Type: Illuminated; Max Voltage Rating (DC): 12V; Manufacturer URL: http://www.te.com/; Lead Free: LeadFree; Packaging: TapeandReel; Min Operating Temperature: -35degC; Mechanical Life: 20000Cycles; Mount: SurfaceMount; REACH SVHC: Unknown; Package Quantity: 1800; Package Reference: FSMSMTR; RoHSCompliant: true; Max Operating Temperature: 85degC; Orientation: Straight; ELV: Compliant; Datasheet URL: http://www.te.com/commerce/DocumentDelivery/DDEController?Action=showdoc&DocId=Customer+Drawing%7F1437566-3%7FC2%7Fpdf%7FEnglish%7FENG_CD_1437566-3_C2_1437566_3_1_c.dwg.pdf%7F1437566-4; Package Description: 2-Pin Surface Mount Device, Body 6 x 3.5 mm, Pitch 9.19 mm; Current Rating: 50mA; Contact Plating: Silver; Termination: GullWing; Datasheet Version: Rev. C2, 08/2014; Contact Material: Brass; Mounting Technology: SurfaceMount
U1 = CMP-0304-00024-2: ARM Cortex-M0 32-bit MCU, 64 KB Flash, 8 KB Internal RAM, 39 I/Os, 48-pin LQFP, -40 to 85 degC, Tray; FLASH Size (Prog) (kB): 64; I/Os (High Current): 39; Operating Frequency(F) (Processor speed) (MHz): 48; Supply Voltage(Vcc) min (V): 2.4; Internal RAM Size (kB): 8; Packing: Tray; ComponentLink2URL: http://www.st.com/st-web-ui/static/active/en/resource/technical/document/datasheet/DM00088500.pdf; PackageVersion: Rev. 6, 06/2013; ComponentLink2Description: Datasheet; PartNumber: STM32F030C8T6; PackageDescription: 48-Pin Low Profile Quad Flat Package, 7 x 7 mm Body, 0.5 mm Pitch; Mounting Technology: Surface Mount; ComponentLink1URL: http://www.st.com/web/en/home.html; PackageReference: LQFP48; ComponentLink3URL: http://www.st.com/st-web-ui/static/active/en/resource/technical/document/datasheet/DM00058181.pdf; DatasheetVersion: Rev. 1; Core: ARM Cortex-M0; ComponentLink1Description: Manufacturer URL; ComponentLink3Description: Package Specification
U2 = CMP-0186-00211-1: USB-to-SPI Protocol Converter with GPIO (Master Mode), 20-Pin SOIC, Industrial Temperature; ComponentLink2URL: http://ww1.microchip.com/downloads/en/DeviceDoc/22288A.pdf; Code_JEDEC: MS-013-AC; PackageDescription: 20-Lead Plastic Small Outline (SO) - Wide 7.50mm Body [SOIC]; ComponentLink1Description: Manufacturer URL; ComponentLink3Description: Package Specification; DatasheetVersion: revA, Dec-2011; PackageReference: SOIC-SO20; Code_IPC: SOIC127P1030-20; ComponentLink3URL: http://www.microchip.com/stellent/groups/techpub_sg/documents/packagingspec/en012702.pdf; ComponentLink1URL: http://www.microchip.com/; PackageVersion: revBB, Aug-2009; ComponentLink2Description: Datasheet
U3 U4 = CMP-0253-00398-1: Cold Junction Compensated Thermocouple to Digital Converter, 14 Bits Temperature Resolution, -40 to 125 degC, 8-Pin SOIC (S8+4), Pb-Free, Tape ang Reel; Interface: SPI; Parasite Pwr.: No; Functions: Thermocouple-to-Digital Converter; ComponentLink3Description: Package Specification; DatasheetVersion: Rev. 2; Generic Part Number: MAX31855; PartNumber: MAX31855KASA+T; PackageReference: S8+4; ComponentLink3URL: http://pdfserv.maximintegrated.com/package_dwgs/21-0041.PDF; Code_JEDEC: MS-012; Packing: Tape ang Reel; PackageDescription: 8-Pin Small-Outline IC, Narrow, Body 3.9 x 4.9 mm, Pitch 1.27 mm; Mounting Technology: Surface Mount; ComponentLink1URL: http://www.maximintegrated.com/; PackageVersion: Rev. D, 10/2012; ComponentLink2URL: http://datasheets.maximintegrated.com/en/ds/MAX31855.pdf; ComponentLink1Description: Manufacturer URL; ComponentLink2Description: Datasheet
VR1 = TS1117BCW50_RPG: Package: None; Price: None; Value: *; MP: TS1117BCW50_RPG; Availability: Unavailable
Y1 Y2 = CMP-1749-00003-1: Resistance Weld Thru-Hole Crystal, 16 MHz, -20 to 70 degC, 2-Pin THD, RoHS, Bulk; Voltage Rating: 250 V; Tolerance: 1%; Resistance: 221 kohm; Case\Package: Axial; Power Rating: 250 mW; RoHSCompliant: true; Package Quantity: 200; Packaging: Bulk; Min Operating Temperature: -55 degC; DatasheetVersion: Mar-15; ComponentLink1URL: http://www.foxonline.com/; Max Operating Temperature: 155 degC; PackageReference: FOXSLF160-20; Mount: Through Hole; PackageDescription: 2-Pin Through Hole Device, Body 11.35 x 4.65 mm; ComponentLink1Description: Manufacturer URL; ComponentLink2URL: http://www.foxonline.com/pdfs/hc49slf.pdf; ComponentLink2Description: Datasheet; Length: 0.248 inch